# EasyEDA Pro project ProProject_音频功放设备耳放1_2025-05-13.epro

# Schematic Schematic1
Create Date: 2025-05-09; Page Name: P1; Project Name: 音频功放设备耳放1; Schematic Name: Schematic1; Update Date: 2025-05-13; Company: 嘉立创EDA; Page Size: A4; Version: V1.0
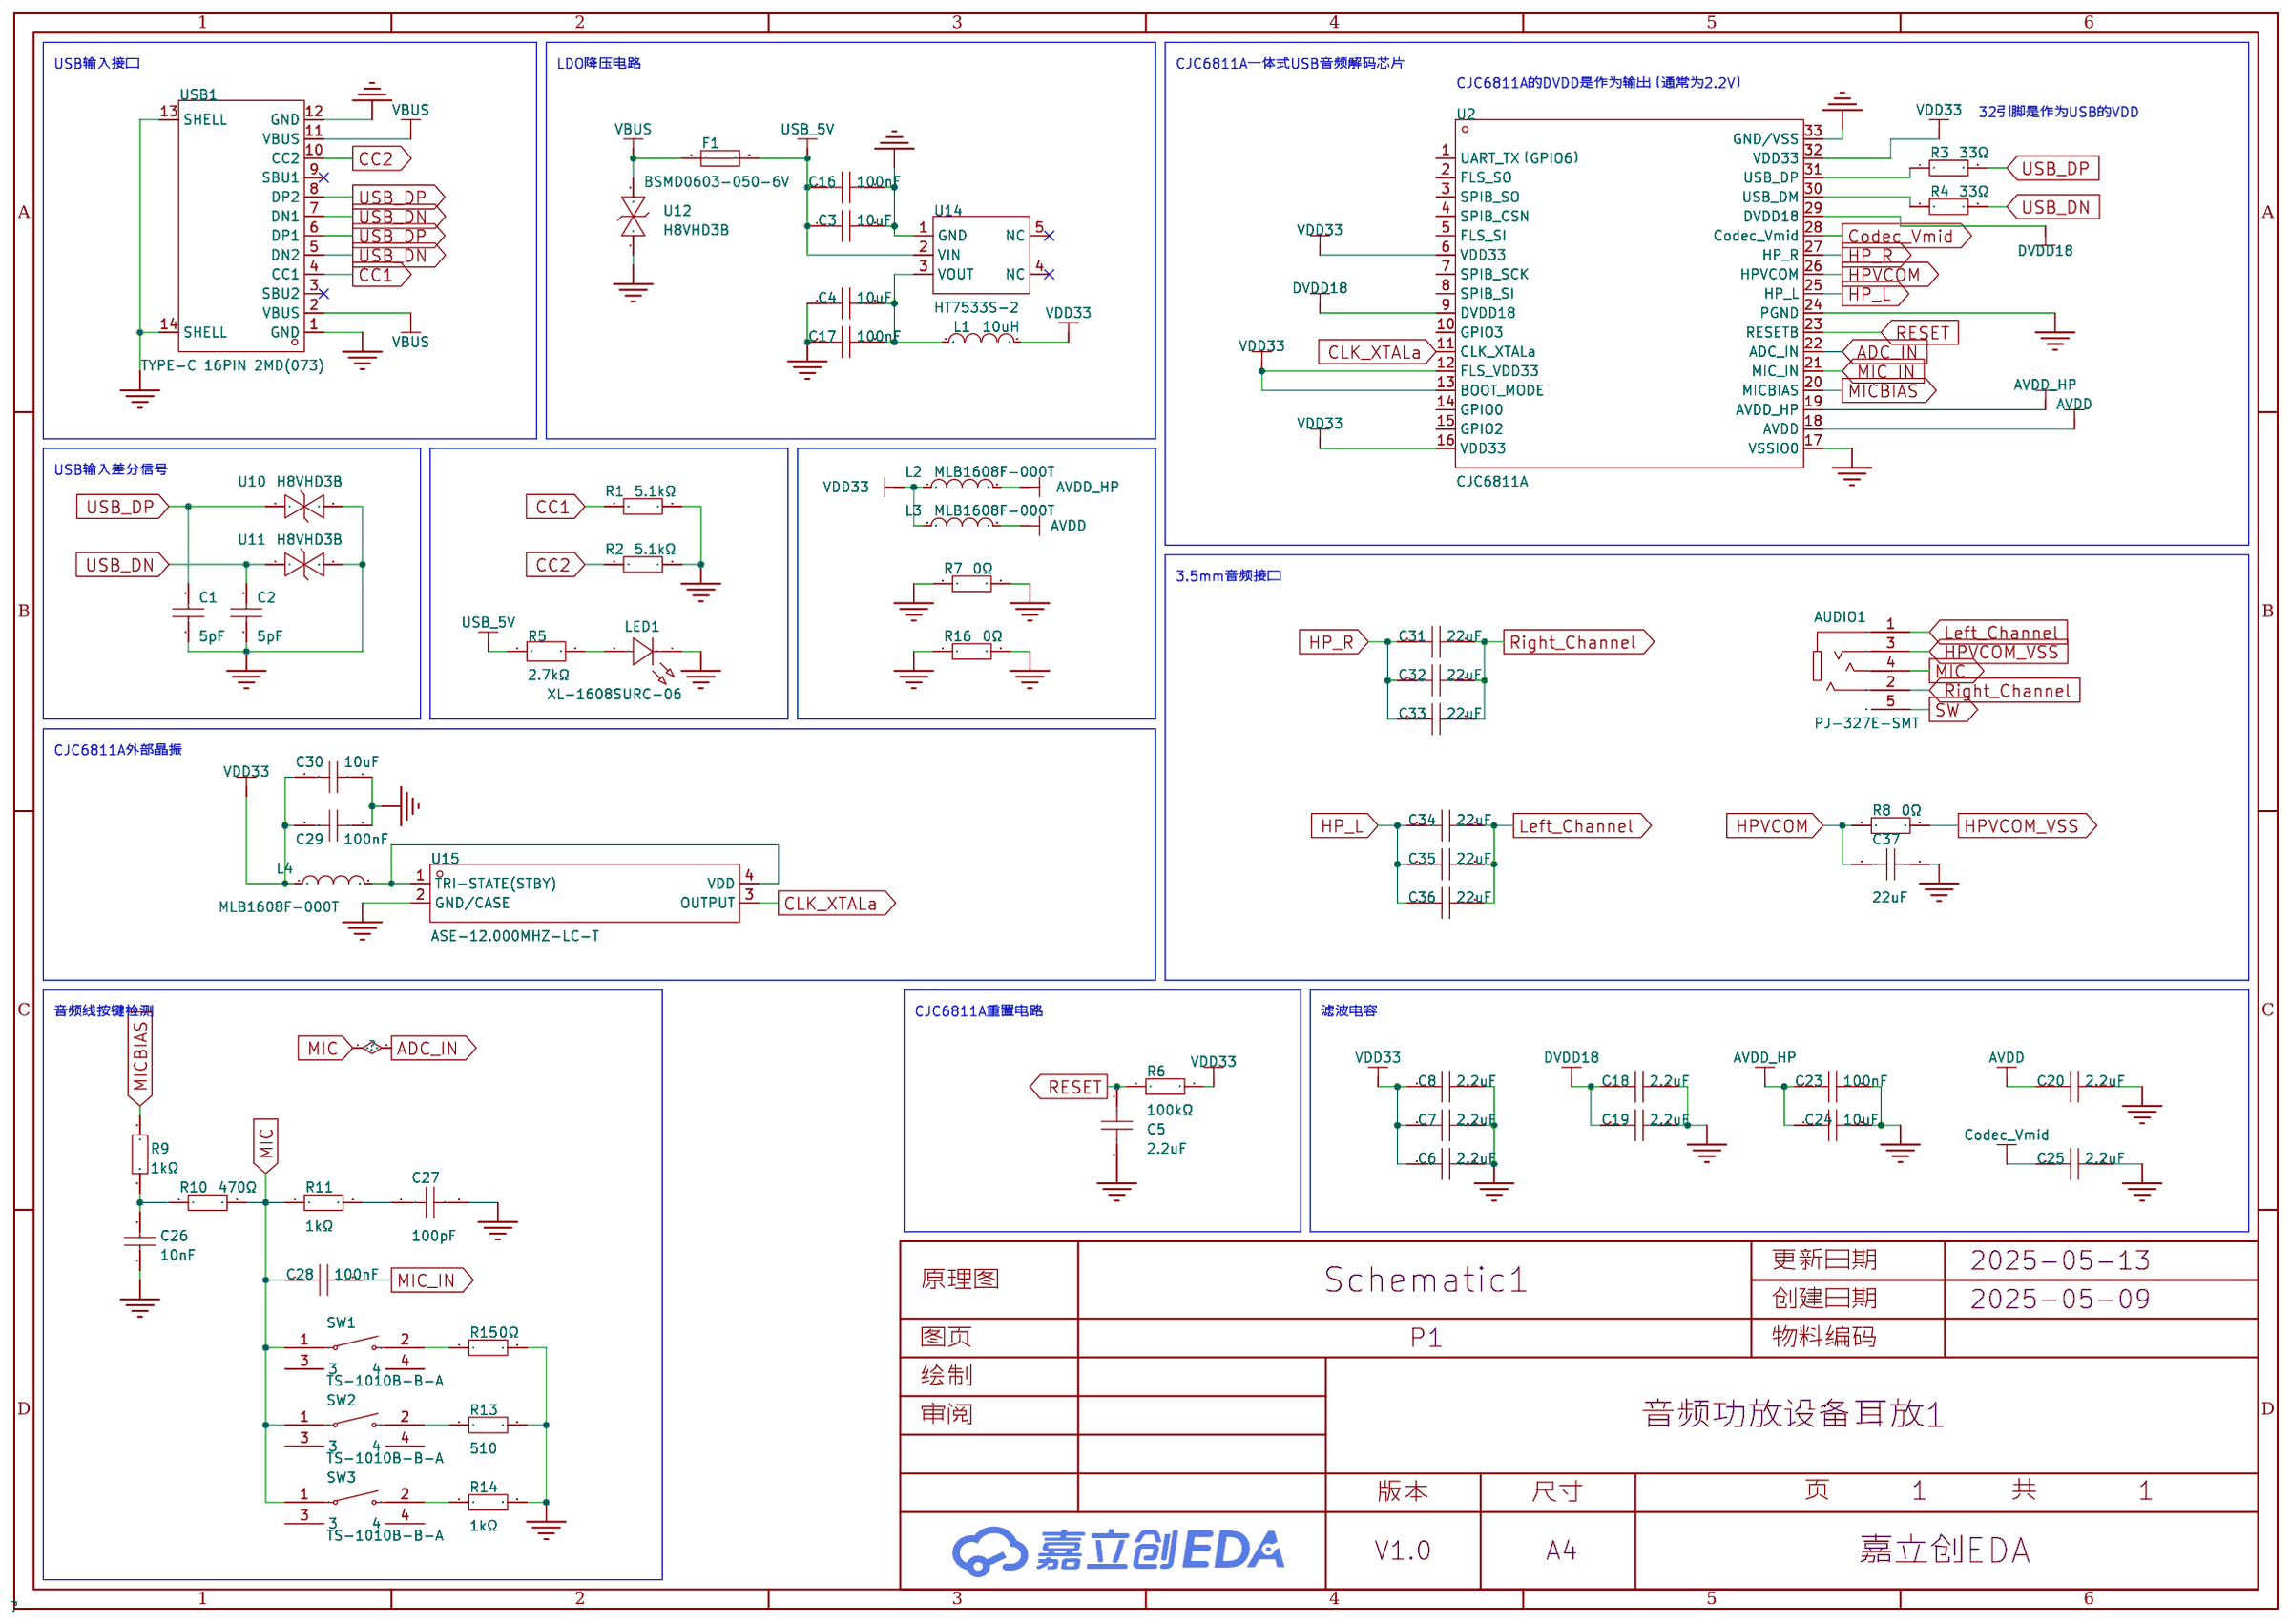
[diagram p0: schematic sheet]

## Parts
AUDIO1  PJ-327E-SMT  [AUDIO-SMD_PJ-327E-SMT]
C1  5pF  [C0603]
C2  5pF  [C0603]
C3  10uF  [C0603]
C4  10uF  [C0603]
C5  2.2uF  [C0603]
C6  2.2uF  [C0603]
C7  2.2uF  [C0603]
C8  2.2uF  [C0603]
C16  100nF  [C0603]
C17  100nF  [C0603]
C18  2.2uF  [C0603]
C19  2.2uF  [C0603]
C20  2.2uF  [C0603]
C23  100nF  [C0603]
C24  10uF  [C0603]
C25  2.2uF  [C0603]
C26  10nF  [C0603]
C27  100pF  [C0603]
C28  100nF  [C0603]
C29  100nF  [C0603]
C30  10uF  [C0603]
C31  22uF  [C0603]
C32  22uF  [C0603]
C33  22uF  [C0603]
C34  22uF  [C0603]
C35  22uF  [C0603]
C36  22uF  [C0603]
C37  22uF  [C0603]
F1  BSMD0603-050-6V  [F0603]
L1  10uH  [L0603]
L2  MLB1608F-000T  [L0603]
L3  MLB1608F-000T  [L0603]
L4  MLB1608F-000T  [L0603]
LED1  XL-1608SURC-06  [LED0603-RD_RED]
R1  5.1kΩ  [R0603]
R2  5.1kΩ  [R0603]
R3  33Ω  [R0603]
R4  33Ω  [R0603]
R5  2.7kΩ  [R0603]
R6  100kΩ  [R0603]
R7  0Ω  [R0603]
R8  0Ω  [R0603]
R9  1kΩ  [R0603]
R10  470Ω  [R0603]
R11  1kΩ  [R0603]
R13  510  [R0603]
R14  1kΩ  [R0603]
R15  0Ω  [R0603]
R16  0Ω  [R0603]
SW1  TS-1010B-B-A  [SW-SMD_TS-1010B-B-A]
SW2  TS-1010B-B-A  [SW-SMD_TS-1010B-B-A]
SW3  TS-1010B-B-A  [SW-SMD_TS-1010B-B-A]
U2  CJC6811A  [QFN-32_L5.0-W5.0-P0.50-BL-EP3.8]
U10  H8VHD3B  [SOD-323_L1.8-W1.3-LS2.7-BI]
U11  H8VHD3B  [SOD-323_L1.8-W1.3-LS2.7-BI]
U12  H8VHD3B  [SOD-323_L1.8-W1.3-LS2.7-BI]
U14  HT7533S-2  [SOT-23-5_L2.9-W1.6-P0.95-LS2.8-BR]
U15  ASE-12.000MHZ-LC-T  [OSC-SMD_4P-L3.2-W2.5-BL]
USB1  TYPE-C 16PIN 2MD(073)  [USB-C-SMD_TYPE-C-6PIN-2MD-073]

## Library data of the parts
AUDIO1 = PJ-327E-SMT: 连接器类型:3.5mm耳机座;额定电流:500mA;额定电压:30V;工作温度范围:-20℃~+70℃;焊接温度(最大值):235℃;; LCSC Part Name: 3.5mm耳机座; Supplier Part: C319105; Manufacturer: XKB Connectivity(中国星坤); Supplier Footprint: SMD; JLCPCB Part Class: 扩展库; Datasheet: https://atta.szlcsc.com/upload/public/pdf/source/20211015/5335F6344674457D7BC015F82D74A0C2.pdf; Supplier: LCSC; Connector Type: 3.5mm耳机座; Current Rating (Max): 500mA; Voltage Rating (Max): 30V; Operating Temperature Range: -20℃~+70℃; Soldering Temperature(Max): 235℃
C1 C2 = 0603CG5R0C500NT: 容值:5pF;额定电压:50V;温度系数:C0G;; LCSC Part Name: ±0.25pF 5pF 50V; Supplier Part: C1673; Manufacturer: FH(风华); Supplier Footprint: 0603; JLCPCB Part Class: 扩展库; Datasheet: https://atta.szlcsc.com/upload/public/pdf/source/20200305/C486355_26A10D38EF8C2A5C37091D0039909270.pdf; Supplier: LCSC; Voltage Rating: 50V; Temperature Coefficient: C0G
C3 C4 C24 C30 = CGA0603X5R106K100JT: 容值:10uF;精度:±10%;额定电压:10V;温度系数:X5R;; LCSC Part Name: 10uF ±10% 10V; Supplier Part: C6119842; Manufacturer: HRE(芯声); Supplier Footprint: 0603; JLCPCB Part Class: 扩展库; Supplier: LCSC; Tolerance: ±10%; Voltage Rating: 10V; Temperature Coefficient: X5R
C5-C8 C18-C20 C25 = CL10A225KB8NNNC: 容值:2.2uF;精度:±10%;额定电压:50V;材质(温度系数):X5R;; LCSC Part Name: 2.2uF ±10% 50V; Supplier Part: C913904; Manufacturer: SAMSUNG(三星); Supplier Footprint: 0603; JLCPCB Part Class: 扩展库; Datasheet: https://atta.szlcsc.com/upload/public/pdf/source/20160218/1457707763339.pdf; Supplier: LCSC; Tolerance: ±10%; Voltage Rated: 50V; Temperature Coefficient: X5R
C16 C17 C23 C28 C29 = CGA0603X7R104K500JT: 容值:100nF;精度:±10%;额定电压:50V;温度系数:X7R;; LCSC Part Name: 100nF ±10% 50V; Supplier Part: C6119867; Manufacturer: HRE(芯声); Supplier Footprint: 0603; JLCPCB Part Class: 扩展库; Datasheet: https://atta.szlcsc.com/upload/public/pdf/source/20250103/C44077DA9E7B3EFAE02F22B6D3D1CBC9.pdf; Supplier: LCSC; Tolerance: ±10%; Voltage Rating: 50V; Temperature Coefficient: X7R
C26 = CC0603KRX7R9BB103: 容值:10nF;精度:±10%;额定电压:50V;材质(温度系数):X7R;; LCSC Part Name: 10nF ±10% 50V; Supplier Part: C100042; Manufacturer: YAGEO(国巨); Supplier Footprint: 0603; JLCPCB Part Class: 扩展库; Datasheet: https://atta.szlcsc.com/upload/public/pdf/source/20181008/C309510_22F155564471FAF6A489F7D68F34234E.pdf; Supplier: LCSC; Tolerance: ±10%; Voltage Rated: 50V; Temperature Coefficient: X7R
C27 = CC0603JRNPO9BN101: 容值:100pF;精度:±5%;额定电压:50V;材质(温度系数):NP0;; LCSC Part Name: 100pF ±5% 50V; Supplier Part: C14665; Manufacturer: YAGEO(国巨); Supplier Footprint: 0603; JLCPCB Part Class: 扩展库; Datasheet: https://atta.szlcsc.com/upload/public/pdf/source/20181008/C309499_21CC21451B82C39E3D92150FD6B30293.pdf; Supplier: LCSC; Tolerance: ±5%; Voltage Rated: 50V; Temperature Coefficient: NP0
C31-C37 = CGA0603X5R226M160JT: 容值:22uF;精度:±20%;额定电压:16V;温度系数:X5R;; LCSC Part Name: 22uF ±20% 16V; Supplier Part: C6119868; Manufacturer: HRE(芯声); Supplier Footprint: 0603; JLCPCB Part Class: 扩展库; Datasheet: https://atta.szlcsc.com/upload/public/pdf/source/20250121/36E435B8815E1026A710792D223DB526.pdf; Supplier: LCSC; Tolerance: ±20%; Voltage Rating: 16V; Temperature Coefficient: X5R
F1 = BSMD0603-050-6V: 最大电压:6V;最大电流:40A;保持电流:500mA;跳闸电流:1A;; LCSC Part Name: 6V 500mA 0603自恢复; Supplier Part: C883095; Manufacturer: BHFUSE(佰宏); Supplier Footprint: 0603; JLCPCB Part Class: 扩展库; Datasheet: https://atta.szlcsc.com/upload/public/pdf/source/20230512/E478DE3555A0061DA0124A9F45802B86.pdf; Supplier: LCSC; Operating Voltage (Max): 6V; Current Rating (Max): 40A; Hold Current: 500mA; Trip Current: 1A; Power Dissipation: 500mW; Resistance - Initial (Ri) (Min): 100mΩ; Resistance - Post Trip (R1) (Max): 800mΩ; Maximum Time to Trip: 100ms; Operating Temperature: -40℃~+85℃
L1 = LQM18FN100M00D: 电感值:10uH;精度:±20%;额定电流:50mA;饱和电流(Isat):50mA;直流电阻(DCR):1.17Ω;; LCSC Part Name: 10uH ±20% 50mA 停产; Supplier Part: C86083; Manufacturer: muRata(村田); Supplier Footprint: 0603; JLCPCB Part Class: 扩展库; Datasheet: https://atta.szlcsc.com/upload/public/pdf/source/20181211/C324471_E5AB673E56FAD8B75EB4C57DC23E4148.pdf; Supplier: LCSC; Tolerance: ±20%; Current Rating: 50mA; Current - Saturation (Isat): 50mA; DC Resistance(DCR): 1.17Ω; Frequency - Self Resonant: 30MHz
L2-L4 = MLB1608F-000T: 阻抗@频率:0Ω@100MHz;误差:±25%;直流电阻(DCR):-;; LCSC Part Name: 单路 0603磁珠 阻抗0Ω@100MHz; Supplier Part: C2844549; Manufacturer: MetalLions(美铼); Supplier Footprint: 0603; JLCPCB Part Class: 扩展库; Datasheet: https://atta.szlcsc.com/upload/public/pdf/source/20230602/7F9B6FFD64AF4C161BE293D8440B9AF6.pdf; Supplier: LCSC; Impedance @ Frequency: 0Ω@100MHz; Tolerance: ±25%; Number of Circuits: 1
LED1 = XL-1608SURC-06: 灯头类型:-;发光颜色:红色;正向压降(Vf):2.3V;功率:50mW;正向电流:20mA;波长:620nm~630nm;二极管配置:-;透镜颜色:无色透明透镜;色温:-;发光强度:225mcd;发光角度:120°;载带方式:正贴;工作温度:-20℃~+85℃;; Supplier Part: C965799; Manufacturer: XINGLIGHT(成兴光); Supplier Footprint: 0603; JLCPCB Part Class: 扩展库; Datasheet: https://atta.szlcsc.com/upload/public/pdf/source/20250213/F9766CE804AF391355DCDD48DB3E0DAB.pdf; Supplier: LCSC; Illumination Color: 红色; Voltage - Forward(Vf): 2.3V; Power(Watts): 50mW; Forward Current: 20mA; Wavelength - Dominant: 620nm~630nm; Peak Wavelength: 625nm; Lens Color: 无色透明透镜; Luminous Intensity: 225mcd; Viewing Angle: 120°; Mounting Sytle: 正贴; Operating Temperature: -20℃~+85℃
R1 R2 = 0603WAF5101T5E: 电阻类型:厚膜电阻;阻值:5.1kΩ;精度:±1%;功率:100mW;最大工作电压:75V;温度系数:±100ppm/℃;; LCSC Part Name: 5.1kΩ ±1% 100mW 厚膜电阻; Supplier Part: C23186; Manufacturer: UNI-ROYAL(厚声); Supplier Footprint: 0603; JLCPCB Part Class: 基础库; Datasheet: https://atta.szlcsc.com/upload/public/pdf/source/20200306/C422600_1E6D84923E4A46A82E41ADD87F860B5C.pdf; Supplier: LCSC; Type: 厚膜电阻; Tolerance: ±1%; Power(Watts): 100mW; Overload Voltage (Max): 75V; Temperature Coefficient: ±100ppm/℃; Operating Temperature Range: -55℃~+155℃
R3 R4 = 0603WAF330JT5E: 电阻类型:厚膜电阻;阻值:33Ω;精度:±1%;功率:100mW;最大工作电压:75V;温度系数:±100ppm/℃;; LCSC Part Name: 33Ω ±1% 100mW 厚膜电阻; Supplier Part: C23140; Manufacturer: UNI-ROYAL(厚声); Supplier Footprint: 0603; JLCPCB Part Class: 基础库; Datasheet: https://atta.szlcsc.com/upload/public/pdf/source/20200306/C422600_1E6D84923E4A46A82E41ADD87F860B5C.pdf; Supplier: LCSC; Type: 厚膜电阻; Tolerance: ±1%; Power(Watts): 100mW; Overload Voltage (Max): 75V; Temperature Coefficient: ±100ppm/℃; Operating Temperature Range: -55℃~+155℃
R5 = FRC0603F2701TS: 电阻类型:厚膜电阻;阻值:2.7kΩ;精度:±1%;功率:100mW;工作电压:75V;温度系数:±100ppm/℃;; LCSC Part Name: 2.7kΩ ±1% 100mW 厚膜电阻; Supplier Part: C2907008; Manufacturer: FOJAN(富捷); Supplier Footprint: 0603; JLCPCB Part Class: 扩展库; Datasheet: https://atta.szlcsc.com/upload/public/pdf/source/20211221/925EC7D7225764EE0046F22065062C87.pdf; Supplier: LCSC; Type: 厚膜电阻; Tolerance: ±1%; Power(Watts): 100mW; Voltage-Supply(Max): 75V; Temperature Coefficient: ±100ppm/℃; Operating Temperature: -55℃~+155℃
R6 = 0603WAF1003T5E: 电阻类型:厚膜电阻;阻值:100kΩ;精度:±1%;功率:100mW;最大工作电压:75V;温度系数:±100ppm/℃;; LCSC Part Name: 100kΩ ±1% 100mW 厚膜电阻; Supplier Part: C25803; Manufacturer: UNI-ROYAL(厚声); Supplier Footprint: 0603; JLCPCB Part Class: 基础库; Datasheet: https://atta.szlcsc.com/upload/public/pdf/source/20200306/C422600_1E6D84923E4A46A82E41ADD87F860B5C.pdf; Supplier: LCSC; Type: 厚膜电阻; Tolerance: ±1%; Power(Watts): 100mW; Overload Voltage (Max): 75V; Temperature Coefficient: ±100ppm/℃; Operating Temperature Range: -55℃~+155℃
R7 R8 R15 R16 = 0603WAF0000T5E: 电阻类型:厚膜电阻;阻值:0Ω;精度:±1%;功率:100mW;最大工作电压:75V;; LCSC Part Name: 0Ω ±1% 100mW 厚膜电阻; Supplier Part: C21189; Manufacturer: UNI-ROYAL(厚声); Supplier Footprint: 0603; JLCPCB Part Class: 基础库; Datasheet: https://atta.szlcsc.com/upload/public/pdf/source/20200306/C422600_1E6D84923E4A46A82E41ADD87F860B5C.pdf; Supplier: LCSC; Type: 厚膜电阻; Tolerance: ±1%; Power(Watts): 100mW; Overload Voltage (Max): 75V; Operating Temperature Range: -55℃~+155℃
R9-R11 R13 R14 = 0603WAF1001T5E: 电阻类型:厚膜电阻;阻值:1kΩ;精度:±1%;功率:100mW;最大工作电压:75V;温度系数:±100ppm/℃;; LCSC Part Name: 1kΩ ±1% 100mW 厚膜电阻; Supplier Part: C21190; Manufacturer: UNI-ROYAL(厚声); Supplier Footprint: 0603; JLCPCB Part Class: 基础库; Datasheet: https://atta.szlcsc.com/upload/public/pdf/source/20200306/C422600_1E6D84923E4A46A82E41ADD87F860B5C.pdf; Supplier: LCSC; Type: 厚膜电阻; Tolerance: ±1%; Power(Watts): 100mW; Overload Voltage (Max): 75V; Temperature Coefficient: ±100ppm/℃; Operating Temperature Range: -55℃~+155℃
SW1-SW3 = TS-1010B-B-A: 电路结构:单刀单掷;按钮形状:矩形按钮;作用力:160gf;安装方式:卧贴;开关长度:4.5mm;开关宽度:2.65mm;开关高度:3.5mm;带支架:不带;触点电流:50mA;额定电压(DC):12V;绝缘电阻:-;带灯:无;机械寿命:10万次;; LCSC Part Name: 4.5*2.65*3.5mm 卧贴 轻触开关; Supplier Part: C381061; Manufacturer: XKB Connectivity(中国星坤); Supplier Footprint: SMD; JLCPCB Part Class: 扩展库; Datasheet: https://atta.szlcsc.com/upload/public/pdf/source/20211011/F72F5FEE4FD72D7D4E4CB639ADBA973D.pdf; Supplier: LCSC; Circuit: 单刀单掷; Actuator Style: 矩形按钮; Operating Force: 160gf; Mounting Style: 卧贴; Switch Length: 4.5mm; Switch Width: 2.65mm; Switch Height: 3.5mm; Strike Gundam: 不带; Contact Current: 50mA; Voltage Rating (DC): 12V; Actuator/Cap Color: 黑色; With Lamp: 无; Mechanical Life: 10万次; Operating Temperature: -30℃~+85℃
U2 = CJC6811A: CPU内核:ARM-M0;程序存储容量:16KB;RAM总容量:16KB;GPIO端口数量:8;工作电压范围:3.3V；1.8V;CPU最大主频:48MHz;程序存储器类型:FLASH;应用领域:-;; Supplier Part: C7431488; Manufacturer: ESHINE(光华芯); Supplier Footprint: QFN5x5-32; JLCPCB Part Class: 扩展库; Datasheet: https://atta.szlcsc.com/upload/public/pdf/source/20241022/C58A102F2C32FEE211FA9C4A97D650DF.pdf; Supplier: LCSC; CPU Core: ARM-M0; Program Storage Size: 16KB; RAM Size: 16KB; GPIO Ports Number: 8; Operating Voltage Range: 3.3V；1.8V; CPU Maximum Speed: 48MHz; Program Memory Type: FLASH; Operating Temperature Range: -20℃~+85℃; 8Bit Timer: 8; 32Bit Timer: 1; UART/USART: 1; I2C: 1; I2S: 1; SPI: 1; Universal Serial Bus: 有; Internal Comparator: 有; Watchdog: 有; Real-Time Clock: 有
U10-U12 = H8VHD3B: 极性:双向;反向截止电压(Vrwm):8V;最大钳位电压:25V;峰值脉冲电流(Ipp):20A;峰值脉冲功率(Ppp):500W;击穿电压:11.5V;; LCSC Part Name: 丝印:AK; Supplier Part: C20615808; Manufacturer: 宏迦橙; Supplier Footprint: SOD-323; JLCPCB Part Class: 扩展库; Datasheet: https://atta.szlcsc.com/upload/public/pdf/source/20240126/4F161BEC9E1B7DCE7F484736647B69CA.pdf; Supplier: LCSC; polarity: 双向; Reverse Stand-Off Voltage (Vrwm): 8V; Maximum Clamping Voltage: 25V; Peak Pulse Current (Ipp): 20A; Peak Pulse Power Dissipation (Ppp): 500W; Breakdown Voltage: 11.5V; Reverse Leakage Current (Ir): 100nA; Operating Temperature: -55℃~+155℃; Type: ESD
U14 = HT7533S-2: 输出类型:固定;工作电压:30V;输出电压:3.3V;输出电流:100mA;电源纹波抑制比(PSRR):-;输出极性:正极;; LCSC Part Name: 线性稳压(LDO); Supplier Part: C3025150; Manufacturer: UMW(友台半导体); Supplier Footprint: SOT-23-5; JLCPCB Part Class: 扩展库; Datasheet: https://atta.szlcsc.com/upload/public/pdf/source/20241210/442D8F583BE08BBCCA568BF38D964031.pdf; Supplier: LCSC; Output Type: 固定; Voltage - Supply: 30V; Output Voltage: 3.3V; Output Current: 100mA; standby current: 2uA; Operating Temperature: -40℃~+85℃; Output Configuration: 正极; Number of Outputs: 1
U15 = ASE-12.000MHZ-LC-T: Supplier Part: C596950; Manufacturer: ABRACON; Supplier Footprint: SMD3225-4P; JLCPCB Part Class: 扩展库; Datasheet: https://atta.szlcsc.com/upload/public/pdf/source/231023/C17182292-f03cdafcace4e2e49e91c2fa8e41e967.pdf; Supplier: LCSC
USB1 = TYPE-C 16PIN 2MD(073): 连接器类型:Type-C;标准:USB 3.1;公母:母;安装方式:卧贴;触点数量:16P;端口数量:1;额定电流 - 电源:5A;工作温度范围:-25℃~+85℃;; LCSC Part Name: Type-C 母 卧贴; Supplier Part: C2765186; Manufacturer: SHOU HAN(首韩); Supplier Footprint: SMD; JLCPCB Part Class: 扩展库; Datasheet: https://atta.szlcsc.com/upload/public/pdf/source/20211123/39B17C16241EAC15C5E277BDA434118E.pdf; Supplier: LCSC; Connector Type: Type-C; Standard: USB 3.1; Gender: 母; Mounting Style: 卧贴; Number of Contacts: 16P; Number of Ports: 1; Current Rating - Power (Max): 5A; Operating Temperature Range: -25℃~+85℃; Rated Voltage (Max): 5V; Connect-Disconnect Life: 5千次; Core Colour: 黑色

## Nets
AGND: C37.2 R13.2 R14.2 R15.2 R16.1 U2.24(PGND)
AVDD: C20.2 L3.2 U2.18(AVDD)
AVDD_HP: C23.1 C24.1 L2.2 U2.19(AVDD_HP)
DGND: U2.33(GND/VSS)
DVDD18: C18.2 C19.2 U2.9(DVDD18) U2.29(DVDD18)
GND: C1.1 C2.1 C5.1 C6.1 C7.1 C8.1 C18.1 C19.1 C20.1 C23.2 C24.2 C25.1 C26.2 C27.2 C29.1 C30.1 R1.2 R2.2 R7.2 R16.2 U2.17(VSSIO0) U10.2 U11.2 U15.2(GND/CASE) USB1.1(GND) USB1.12(GND) USB1.13(SHELL) USB1.14(SHELL)
PGND: C3.2 C4.1 C16.2 C17.1 LED1.1(K) R7.1 U12.1 U14.1(GND)
VBUS: F1.1 U12.2 USB1.2(VBUS) USB1.11(VBUS)
VDD33: C6.2 C7.2 C8.2 C29.2 C30.2 L1.2 L2.1 L3.1 L4.1 R6.2 U2.6(VDD33) U2.12(FLS_VDD33) U2.13(BOOT_MODE) U2.16(VDD33) U2.32(VDD33)
ADC_IN: AUDIO1.4 C28.1 R10.2 R11.1 SW1.1 SW2.1 SW3.1 U2.22(ADC_IN)
CC1: R1.1 USB1.4(CC1)
CC2: R2.1 USB1.10(CC2)
CLK_XTALa: U2.11(CLK_XTALa) U15.3(OUTPUT)
Codec_Vmid: C25.2 U2.28(Codec_Vmid)
HP_L: C34.1 C35.1 C36.1 U2.25(HP_L)
HP_R: C31.1 C32.1 C33.1 U2.27(HP_R)
HPVCOM: C37.1 R8.1 U2.26(HPVCOM)
HPVCOM_VSS: AUDIO1.3 R8.2
Left_Channel: AUDIO1.1 C34.2 C35.2 C36.2
MIC_IN: C28.2 U2.21(MIC_IN)
MICBIAS: R9.1 U2.20(MICBIAS)
RESET: C5.2 R6.1 U2.23(RESETB)
Right_Channel: AUDIO1.2 C31.2 C32.2 C33.2
SW: AUDIO1.5
USB_5V: C3.1 C16.1 F1.2 R5.1 U14.2(VIN)
USB_DN: C2.2 R4.2 U11.1 USB1.5(DN2) USB1.7(DN1)
USB_DP: C1.2 R3.2 U10.1 USB1.6(DP1) USB1.8(DP2)
$1N3255: R3.1 U2.31(USB_DP)
$1N3294: R4.1 U2.30(USB_DM)
$1N3811: LED1.2(A) R5.2
$1N6901: C4.2 C17.2 L1.1 U14.3(VOUT)
$1N9188: C26.1 R9.2 R10.1
$1N9400: C27.1 R11.2
$1N10061: R15.1 SW1.2
$1N10064: R13.1 SW2.2
$1N10067: R14.1 SW3.2
$1N10464: L4.2 U15.1(TRI-STATE(STBY)) U15.4(VDD)

Not connected (* = marked no-connect by the designer): SW1 3 4; SW2 3 4; SW3 3 4; U2 1(UART_TX（GPIO6）) 2(FLS_SO) 3(SPIB_SO) 4(SPIB_CSN) 5(FLS_SI) 7(SPIB_SCK) 8(SPIB_SI) 10(GPIO3) 14(GPIO0) 15(GPIO2); U14 4(NC)* 5(NC)*; USB1 3(SBU2)* 9(SBU1)*

## Notes on the sheet
- USB输入接口
- LDO降压电路
- CJC6811A一体式USB音频解码芯片
- CJC6811A的DVDD是作为输出（通常为2.2V）
- 32引脚是作为USB的VDD
- USB输入差分信号
- 3.5mm音频接口
- CJC6811A外部晶振
- 音频线按键检测
- CJC6811A重置电路
- 滤波电容

# Board PCB1
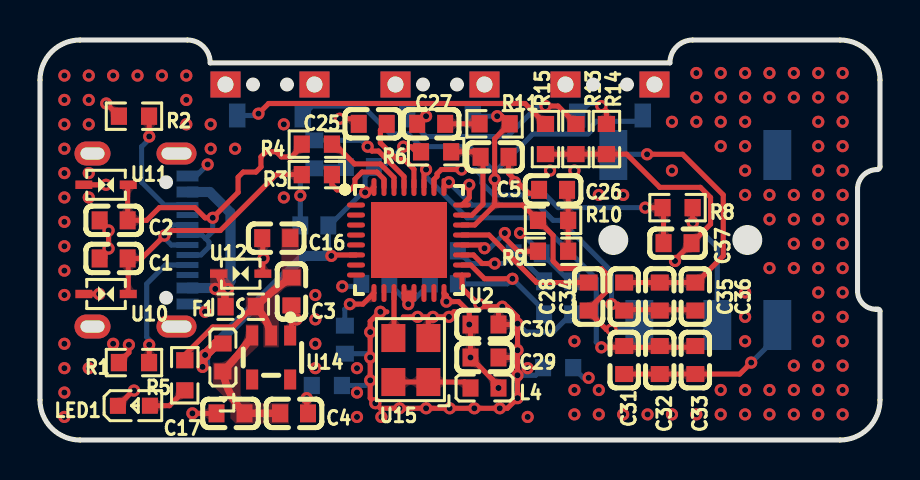
[diagram p1: board, top side]
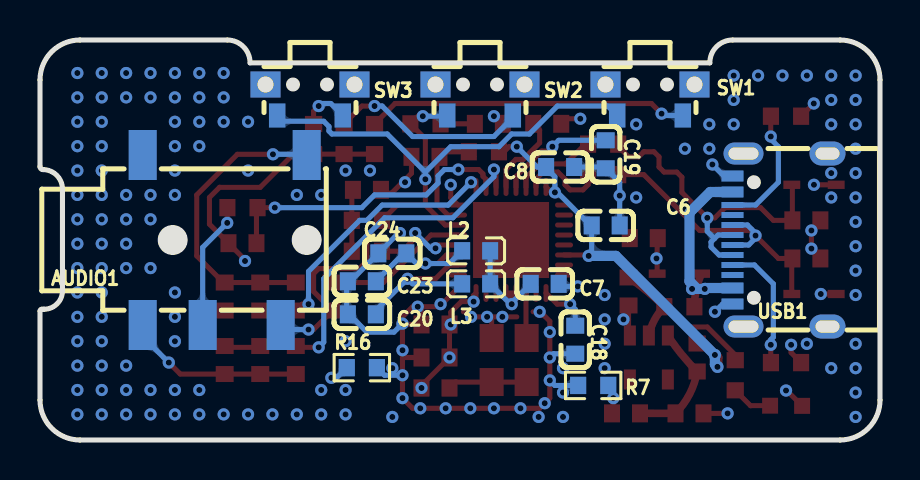
[diagram p2: board, bottom side, seen from below]

Outline 42 x 20 mm; copper layers: Top Layer, Inner1, Inner2, Bottom Layer. Coordinates in mm from the lower left corner of the outline.
Outline path: 0,18 arc(0.59,19.41) 2,20 7.37,20 arc(8.17,19.67) 8.51,18.86 31.5,18.86 arc(31.83,19.67) 32.64,20 40,20 arc(41.41,19.41) 42,18 42,13.66 arc(41.96,13.56) 41.86,13.52 arc(41.16,13.23) 40.88,12.54 40.88,7.46 arc(41.15,6.81) 41.8,6.54 41.91,6.54 arc(41.97,6.51) 42,6.45 42,2 arc(41.41,0.59) 40,0 2,0 arc(0.59,0.59) 0,2 0,18
Stack: Top Layer 0.035mm 外层铜厚1oz / Dielectric1 0.2104mm 7628 RC49% 8.6mil / Inner1 0.0152mm 内层铜厚 / Dielectric2 1.065mm 1.1mm H/HOZ 含铜 / Inner2 0.0152mm 内层铜厚 / Dielectric3 0.2104mm 7628 RC49% 8.6mil / Bottom Layer 0.035mm 外层铜厚1oz

## Design rules (mm)
net $1N3294: DP1
net $1N3255: DP1
template: JLCPCB Capability(Two Layers Board)
spacing copperThickness1oz (default): track to track 0.102, other pairs 0.152 to 0.3
spacing copperThickness2oz: track to track 0.203, other pairs 0.152 to 0.3
track width copperThickness1oz (default): min 0.127, default 0.254, max 2.54
track width copperThickness2oz: min 0.203, default 0.254, max 2.54
differential pair differentialPair (default): width min 0.127, default 0.254, max 2.54; gap min 0.152, default 0.152
via viaSize (default): diameter min 0.5, default 0.61, max 10; hole min 0.3, default 0.305, max 6.3

## Placement (name value [footprint] x y rotation side)
AUDIO1  PJ-327E-SMT  [AUDIO-SMD_PJ-327E-SMT]  32.77 10 270 bottom
C1  5pF  [C0603]  3.68 9.08 0 top
C2  5pF  [C0603]  3.68 10.98 0 top
C3  10uF  [C0603]  12.57 7.43 270 top
C4  10uF  [C0603]  12.7 1.33 180 top
C5  2.2uF  [C0603]  22.73 14.16 180 top
C6  2.2uF  [C0603]  13.72 10.73 0 bottom
C7  2.2uF  [C0603]  16.76 7.81 0 bottom
C8  2.2uF  [C0603]  15.99 13.65 0 bottom
C16  100nF  [C0603]  11.81 10.09 180 top
C17  100nF  [C0603]  9.53 1.33 0 top
C18  2.2uF  [C0603]  15.24 5.01 90 bottom
C19  2.2uF  [C0603]  13.72 14.28 90 bottom
C20  2.2uF  [C0603]  25.91 6.28 180 bottom
C23  100nF  [C0603]  25.91 7.94 0 bottom
C24  10uF  [C0603]  24.38 9.33 0 bottom
C25  2.2uF  [C0603]  16.64 15.81 0 top
C26  10nF  [C0603]  25.65 12.51 180 top
C27  100pF  [C0603]  19.56 15.81 180 top
C28  100nF  [C0603]  27.43 7.17 90 top
C29  100nF  [C0603]  22.22 4.12 180 top
C30  10uF  [C0603]  22.22 5.78 180 top
C31  22uF  [C0603]  29.21 4 270 top
C32  22uF  [C0603]  30.99 4 270 top
C33  22uF  [C0603]  32.77 4 270 top
C34  22uF  [C0603]  29.21 7.17 90 top
C35  22uF  [C0603]  30.99 7.17 90 top
C36  22uF  [C0603]  32.77 7.17 90 top
C37  22uF  [C0603]  31.88 9.84 0 top
F1  BSMD0603-050-6V  [F0603]  10.03 6.67 0 top
L1  10uH  [L0603]  9.14 4.12 90 top
L2  MLB1608F-000T  [L0603]  20.19 9.46 0 bottom
L3  MLB1608F-000T  [L0603]  20.19 7.81 0 bottom
L4  MLB1608F-000T  [L0603]  22.22 2.6 180 top
LED1  XL-1608SURC-06  [LED0603-RD_RED]  4.69 1.71 0 top
R1  5.1kΩ  [R0603]  4.7 3.87 180 top
R2  5.1kΩ  [R0603]  4.7 16.19 180 top
R3  33Ω  [R0603]  13.84 13.27 180 top
R4  33Ω  [R0603]  13.84 14.79 180 top
R5  2.7kΩ  [R0603]  7.24 3.24 270 top
R6  100kΩ  [R0603]  19.81 14.41 180 top
R7  0Ω  [R0603]  14.34 2.73 0 bottom
R8  0Ω  [R0603]  31.88 11.62 0 top
R9  1kΩ  [R0603]  25.65 9.44 0 top
R10  470Ω  [R0603]  25.65 10.98 180 top
R11  1kΩ  [R0603]  22.73 15.81 180 top
R13  510  [R0603]  26.8 15.05 270 top
R14  1kΩ  [R0603]  28.32 15.05 270 top
R15  0Ω  [R0603]  25.27 15.05 270 top
R16  0Ω  [R0603]  25.91 3.62 180 bottom
SW1  TS-1010B-B-A  [SW-SMD_TS-1010B-B-A]  11.5 17 180 bottom
SW2  TS-1010B-B-A  [SW-SMD_TS-1010B-B-A]  20 17 180 bottom
SW3  TS-1010B-B-A  [SW-SMD_TS-1010B-B-A]  28.5 17 180 bottom
U2  CJC6811A  [QFN-32_L5.0-W5.0-P0.50-BL-EP3.8]  18.45 10 270 top
U10  H8VHD3B  [SOD-323_L1.8-W1.3-LS2.7-BI]  3.3 7.3 180 top
U11  H8VHD3B  [SOD-323_L1.8-W1.3-LS2.7-BI]  3.3 12.76 180 top
U12  H8VHD3B  [SOD-323_L1.8-W1.3-LS2.7-BI]  10.03 8.32 180 top
U14  HT7533S-2  [SOT-23-5_L2.9-W1.6-P0.95-LS2.8-BR]  11.56 4.12 90 top
U15  ASE-12.000MHZ-LC-T  [OSC-SMD_4P-L3.2-W2.5-BL]  18.54 4 90 top
USB1  TYPE-C 16PIN 2MD(073)  [USB-C-SMD_TYPE-C-6PIN-2MD-073]  5 10 90 bottom

## Footprints (pads in the part's own frame, mm; a bottom-side part is the same pattern mirrored in y, then rotated)
AUDIO-SMD_PJ-327E-SMT
  rect 2.5x1.4 smd: 1(-4.25,4.1) 2(4.25,-4.1) 3(4.25,-1.1) 4(4.25,2.8) 5(-4.25,-4.1)
C0603
  rect 0.8x0.9 smd: 1(-0.7,0) 2(0.7,0)
F0603
  rect 0.806x0.864 smd: 1(-0.753,0) 2(0.753,0)
L0603
  rect 0.8x0.864 smd: 1(-0.7,0) 2(0.7,0)
LED0603-RD_RED
  rect 0.8x0.8 smd: 1(-0.799,-0.004) 2(0.799,0.004)
OSC-SMD_4P-L3.2-W2.5-BL
  rect 1.4x1.2 smd: 1(-1.1,-0.875) 2(1.1,-0.875) 3(1.1,0.875) 4(-1.1,0.875)
QFN-32_L5.0-W5.0-P0.50-BL-EP3.8
  oval 0.25x0.9 smd: 1(-1.75,-2.65) 2(-1.25,-2.65) 3(-0.749,-2.65) 4(-0.249,-2.65) 5(0.249,-2.65) 6(0.75,-2.65) 7(1.25,-2.65) 8(1.75,-2.65) 17(1.75,2.65) 18(1.25,2.65) 19(0.75,2.65) 20(0.249,2.65) 21(-0.249,2.65) 22(-0.749,2.65) 23(-1.25,2.65) 24(-1.75,2.65)
  oval 0.9x0.25 smd: 9(2.65,-1.75) 10(2.65,-1.25) 11(2.65,-0.75) 12(2.65,-0.249) 13(2.65,0.249) 14(2.65,0.749) 15(2.65,1.25) 16(2.65,1.75) 25(-2.65,1.75) 26(-2.65,1.25) 27(-2.65,0.749) 28(-2.65,0.249) 29(-2.65,-0.249) 30(-2.65,-0.75) 31(-2.65,-1.25) 32(-2.65,-1.75)
  rect 3.8x3.8 smd: 33(0,0)
R0603
  rect 0.806x0.864 smd: 1(-0.753,0) 2(0.753,0)
SOD-323_L1.8-W1.3-LS2.7-BI
  rect 0.845x0.42 smd: 1(-1.11,0) 2(1.11,0)
SOT-23-5_L2.9-W1.6-P0.95-LS2.8-BR
  rect 1x0.6 smd: 1(1.1,-0.95) 2(1.1,0) 3(1.1,0.95) 4(-1.1,0.95) 5(-1.1,-0.95)
SW-SMD_TS-1010B-B-A
  rect 0.825x1.2 smd: 1(-1.64,-0.775) 2(1.64,-0.775)
  rect 1.5x1.3 hole 0.8: 3(-2.225,0.775) 4(2.225,0.775)
USB-C-SMD_TYPE-C-6PIN-2MD-073
  rect 0.55x1.1 smd: 1(-3.2,2.375) 2(-2.4,2.375) 11(2.4,2.375) 12(3.2,2.375)
  rect 0.3x1.1 smd: 3(-1.75,2.375) 4(-1.25,2.375) 5(-0.75,2.375) 6(-0.25,2.375) 7(0.25,2.375) 8(0.75,2.375) 9(1.25,2.375) 10(1.75,2.375)
  oval 1.2x1.8 hole 0.6x1.2: 13(-4.325,-2.375) 14(4.325,-2.375)
  oval 1.1x2 hole 0.6x1.5: 13(-4.325,1.825) 14(4.325,1.825)

## Nets
As in the schematic, except:
CLK_XTALA: U2.11 U15.3
CODEC_VMID: C25.2 U2.28
LEFT_CHANNEL: AUDIO1.1 C34.2 C35.2 C36.2
RIGHT_CHANNEL: AUDIO1.2 C31.2 C32.2 C33.2

Pads without a net: SW1 3 4; SW2 3 4; SW3 3 4; U2 1 2 3 4 5 7 8 10 14 15; U14 4 5; USB1 3 9

## Via types
v1: diameter 0.61, hole 0.305, Top Layer to Bottom Layer, 201 vias

## Routing (per net, layer and track width the routed paths; a pad name or vN(x,y) marks a point on that pad's centre or on a via; arc(x,y) is an arc through that point)
AGND: length 121.2
  Top Layer w0.254: v1(31.75,8.95) 31.75,9.01 C37.2 33.53,10.79 33.53,12.13 33.02,12.63 30.99,12.63 29.33,14.29 R14.2 R13.2 R15.2 ; U2.24 21.46,12.11 v1(21.46,12.76)
  Inner1 w0.254: 22.5,13.8 23.85,13.8 24.76,12.89 24.76,10.09 24.26,9.59 23.11,9.59 21.84,10.86 19.81,10.86 19.81,8.06 20.32,7.55 23.05,7.55 25.74,4.87 25.74,1.37 26.69,0.43 30.18,0.43 ; 22.5,13.8 v1(21.46,12.76) 20.96,12.25 19.69,12.25 16.69,15.25 15.75,15.25 15.75,15.68 18.67,15.68 18.8,15.56 19.69,15.56 19.94,15.81 19.94,16.57 20.19,16.83 23.11,16.83 23.5,17.21 23.5,18.09 23.75,18.35 25.02,18.35 25.15,18.22 25.15,17.33 25.02,17.33 24.64,16.95 24.64,16.19 24.76,16.06 ; 22.5,13.8 24.76,16.06 ; 24.76,16.06 28.83,16.06 29.34,16.57 31.62,16.57 32.13,17.08 32.13,18.73 32.97,19.57 40,19.57 arc(41.11,19.11) 41.57,18 41.57,13.98 41.49,13.9 arc(40.74,13.4) 40.45,12.54 40.45,7.46 arc(40.75,6.61) 41.53,6.14 ; 30.18,0.43 40,0.43 arc(40.97,0.76) 41.53,1.62 ; 30.18,0.43 30.35,0.43 ; 41.53,6.14 41.53,3.45 41.54,3.43 41.54,1.7 ; 41.53,6.14 arc(41.55,6.13) 41.57,6.13 ; 41.54,1.7 arc(41.54,1.66) 41.53,1.62 ; 41.54,1.7 arc(41.57,1.85) 41.57,2 ; 41.54,1.7 arc(41.54,1.66) 41.53,1.62
  Bottom Layer w0.254: v1(27.43,3.11) 27.17,3.11 R16.1
  vias: v1(25.5,13.47) v1(26.72,13.47) v1(26.72,4.94) v1(26.72,2.5) v1(26.72,1.28) v1(27.94,12.25) v1(27.94,2.5) v1(27.94,1.28) v1(29.16,12.25) v1(29.16,1.28) v1(30.38,1.28) v1(31.6,15.91) v1(31.6,13.47) v1(31.6,1.28) v1(32.82,18.35) v1(32.82,17.13) v1(32.82,15.91) v1(32.82,1.28) v1(34.04,18.35) v1(34.04,17.13) v1(34.04,15.91) v1(34.04,14.69) v1(34.04,2.5) v1(34.04,1.28) v1(35.25,18.35) v1(35.25,17.13) v1(35.25,15.91) v1(35.25,14.69) v1(35.25,13.47) v1(35.25,12.25) v1(35.25,7.38) v1(35.25,6.16) v1(35.25,4.94) v1(35.25,2.5) v1(35.25,1.28) v1(36.47,18.35) v1(36.47,17.13) v1(36.47,12.25) v1(36.47,11.03) v1(36.47,8.6) v1(36.47,2.5) v1(36.47,1.28) v1(37.69,18.35) v1(37.69,17.13) v1(37.69,12.25) v1(37.69,11.03) v1(37.69,9.81) v1(37.69,8.6) v1(37.69,3.72) v1(37.69,2.5) v1(37.69,1.28) v1(38.91,18.35) v1(38.91,17.13) v1(38.91,15.91) v1(38.91,14.69) v1(38.91,13.47) v1(38.91,12.25) v1(38.91,11.03) v1(38.91,9.81) v1(38.91,8.6) v1(38.91,7.38) v1(38.91,6.16) v1(38.91,4.94) v1(38.91,3.72) v1(38.91,2.5) v1(38.91,1.28) v1(40.13,18.35) v1(40.13,17.13) v1(40.13,15.91) v1(40.13,14.69) v1(40.13,13.47) v1(40.13,12.25) v1(40.13,11.03) v1(40.13,9.81) v1(40.13,8.6) v1(40.13,7.38) v1(40.13,6.16) v1(40.13,4.94) v1(40.13,3.72) v1(40.13,2.5) v1(40.13,1.28)
AVDD: length 8.1
  Top Layer w0.254: U2.18 21.54,8.75 22.22,8.06 v1(23.62,8.06)
  Bottom Layer w0.254: C20.2 25.21,6.48 v1(23.62,8.06) 23.37,7.81 L3.2
AVDD_HP: length 7.2
  Top Layer w0.254: U2.19 21.68,9.25 22.1,8.82 v1(22.73,8.82)
  Bottom Layer w0.254: C23.1 23.84,9.3 23.65,9.3 ; 23.65,9.3 23.18,8.82 v1(22.73,8.82) 21.53,8.82 L2.2 ; 23.65,9.3 C24.1
DVDD18: length 17.4
  Top Layer w0.254: v1(15.49,6.79) 16.14,6.79 U2.9 ; U2.29 18.2,13.17 16.93,14.45 16.6,14.45 v1(16.38,14.67)
  Inner2 w0.254: v1(15.49,6.79) 17.27,8.57 17.27,13.78 v1(16.38,14.67)
  Bottom Layer w0.254: C18.2 15.24,6.54 v1(15.49,6.79) ; C19.2 16.06,14.98 v1(16.38,14.67)
GND: length 118.5
  Top Layer w0.254: C29.1 23.75,4.12 ; v1(14.99,16.06) 15.68,16.06 C25.1 ; 22.99,5.78 23.83,5.78 v1(23.88,5.82) ; 22.93,6.67 C30.1 ; 22.93,6.67 v1(23.11,6.67) 23.37,6.67 23.88,6.16 v1(23.88,5.82) ; 22.93,6.67 22.04,6.67 21.1,7.6 U2.17 ; C1.1 3.43,9.52 3.43,10.54 C2.1 ; 19.42,6.16 v1(20.45,6.16) 20.7,6.41 20.83,6.41 ; 19.42,6.16 U15.2 ; 19.42,6.16 v1(18.88,6.16) 18.16,6.16 ; 3.3,16.83 v1(3.31,16.83) R2.2 ; v1(23.88,5.82) v1(23.88,4.49) v1(23.88,3.24) v1(23.88,2.09) 23.37,1.58 v1(22.99,1.58) v1(21.72,1.58) v1(20.48,1.58) v1(19.3,1.58) v1(17.98,1.58) 17.02,1.58 v1(16.76,1.84) 16.51,2.09 v1(16.51,2.98) v1(16.51,4.12) v1(16.51,5.39) 16.51,5.94 16.99,6.41 17.34,6.41 ; C27.2 19.24,16.19 v1(19.3,16.19) ; v1(4.44,4.76) 4.44,4.37 R1.2 ; U10.2 2.92,7.3 ; C26.2 24.78,12.34 24.43,12.34 23.43,13.34 C5.1 ; U11.2 v1(3.3,12.76)
  Inner1 w0.254: v1(3.43,9.57) 3.43,7.77 v1(2.96,7.3) 2.96,6.01 USB1.13 3.53,5.67 v1(4.44,4.76) 5.36,5.67 USB1.13 7.52,5.67 v1(8.25,6.41) ; 23.75,11.95 23.75,11.87 24,11.62 v1(24,10.35) ; 23.75,11.95 23.04,11.24 20.12,11.24 ; 23.75,11.95 v1(23.75,12.89) 23.41,12.89 22.4,11.87 20.19,11.87 ; v1(18.88,6.16) 17.27,6.16 v1(17.02,6.41) 15.75,7.68 v1(15.11,7.68) 14.48,7.68 13.59,8.57 13.59,11.65 v1(13.02,12.22) ; v1(13.02,12.22) 14.99,14.19 v1(14.99,16.06) 19.18,16.06 v1(19.3,16.19) ; v1(13.02,12.22) 11.46,13.78 v1(8.38,13.78) 7.83,14.33 USB1.14 6.82,15.08 5.08,16.83 v1(3.31,16.83) 2.62,16.14 USB1.14 2.62,13.44 v1(3.3,12.76) 3.43,12.63 v1(3.43,10.47)
  Bottom Layer w0.254: v1(15.11,7.68) 15.94,7.68 C7.1 ; C20.1 26.67,6.35 26.67,6.41 ; v1(24,10.35) 24.07,10.35 C24.2 26.48,7.94 C23.2 ; 26.67,7.94 26.67,6.41 ; 26.67,6.41 25.65,5.39 24.3,5.39 v1(23.88,5.82) ; v1(8.38,13.78) 7.81,13.2 USB1.12 ; R16.2 24.77,3.24 v1(23.88,3.24) ; C6.1 v1(13.02,12.22) 13.02,12.89 C19.1 13.78,13.65 C8.1 ; R7.2 16.26,2.73 v1(16.51,2.98) ; v1(16.51,4.12) 16.32,4.31 C18.1 ; v1(8.25,6.41) 7.87,6.8 USB1.1
  vias: v1(1.22,18.22) v1(1.22,17) v1(1.22,15.78) v1(1.22,14.56) v1(1.22,13.34) v1(1.22,12.13) v1(1.22,10.91) v1(1.22,9.69) v1(1.22,8.47) v1(1.22,7.25) v1(1.22,4.81) v1(1.22,3.59) v1(1.22,2.37) v1(1.22,1.15) v1(2.44,18.22) v1(2.44,17) v1(2.44,15.78) v1(2.44,13.34) v1(2.44,12.13) v1(2.44,3.59) v1(3.66,18.22) v1(3.66,4.81) v1(4.88,18.22) v1(6.1,18.22) v1(7.31,18.22) v1(7.31,17) v1(7.31,15.78) v1(8.53,15.78) v1(8.53,14.56) v1(9.75,14.56) v1(12.19,15.78) v1(12.19,12.13) v1(15.85,3.59) v1(15.85,2.37) v1(15.85,1.15) v1(17.07,1.15) v1(19.65,6.16) v1(21.97,6.79) v1(24.38,3.59) v1(24.38,1.15)
PGND: length 65.6
  Top Layer w0.254: 12.51,5.22 12.57,5.29 12.57,6.01 ; v1(13.34,2.09) 13.34,1.4 C4.1 ; 12.57,6.01 12.83,6.01 ; 12.57,6.01 C3.2 ; 8.82,1.33 v1(7.62,1.33) ; C16.2 11.14,10.06 U12.1 ; LED1.1 4.66,2.47 v1(4.7,2.47)
  Inner1 w0.254: 8.54,7.01 8.64,6.92 8.76,6.92 8.89,6.79 8.89,6.03 7.62,4.76 6.99,4.76 6.35,4.12 6.35,3.62 5.97,3.24 5.33,3.24 ; 5.33,3.24 4.7,2.6 v1(4.7,2.47) 6.48,2.47 v1(7.62,1.33) 8.38,2.09 v1(13.34,2.09) 13.34,5.52 v1(12.83,6.03) 11.18,7.68 v1(11.18,9.08) ; 5.33,3.24 3.81,3.24 2.92,2.35 2.92,0.82 3.32,0.43 14.08,0.43 14.35,0.7 14.35,7.3 13.21,8.44 13.21,10.6 12.95,10.86 10.29,10.86 8.13,8.7 8.13,7.3 8.48,6.95
  vias: v1(13.77,7.25) v1(13.77,6.03) v1(13.77,4.81) v1(13.77,3.59)
VBUS: length 10.9
  Top Layer w0.381: F1.1 arc(9.19,7.51) 8.92,8.32
  Inner2 w0.508: v1(8.76,7.55) v1(9.4,7.55)
  Bottom Layer w0.508: 9.14,7.55 9.53,7.94 9.53,11.36 8.49,12.4 USB1.11 ; 9.14,7.55 v1(8.76,7.55) 8.72,7.6 USB1.2 ; 9.14,7.55 v1(9.4,7.55)
VDD33: length 70
  Top Layer w0.254: 18.54,7.3 18.54,6.92 v1(18.41,6.79) 18.41,7.14 U2.12 U2.13 ; C30.2 v1(21.53,4.12) 22.93,2.72 v1(22.93,2.6) ; v1(16.26,12.38) 16.43,12.38 U2.32 ; U2.6 14.61,9.25 v1(14.57,9.2) ; v1(18.16,14.67) 18.55,14.67 18.8,14.41 ; v1(21.46,5.78) 21.46,6.39 20.93,6.92 v1(20.32,6.92) 20.32,7.23 U2.16
  Top Layer w0.508: 8.13,3.62 8.13,4.12 8.83,4.83 L1.2
  Inner2 w0.254: v1(14.57,9.2) 14.35,8.99 14.35,6.54 14.86,6.03 15.75,6.03 16.26,6.54 16.26,6.79 16.64,7.17 18.03,7.17 v1(18.41,6.79) 20.19,6.79 v1(20.32,6.92) 20.75,6.92 21.46,6.21 v1(21.46,5.78) 21.46,4.25 22.99,2.73 22.99,2.6
  Inner2 w0.508: v1(18.16,14.67) 18.41,14.41 v1(18.41,6.79) ; v1(8.25,4.25) 8.13,4.12 v1(8.13,3.66) 13.68,9.2 v1(14.57,9.2) 14.57,10.69 v1(16.26,12.38)
  Bottom Layer w0.254: C6.2 14.42,9.36 v1(14.57,9.2) ; C8.2 16.75,13.65 ; 16.75,13.65 16.26,13.16 v1(16.26,12.38) 16.13,12.38 14.48,10.73 ; 16.75,13.65 17.15,13.65 v1(18.16,14.67) ; C7.2 18.41,6.86 v1(18.41,6.79) 18.48,6.79 19.49,7.81 19.49,9.46
  Bottom Layer w0.508: v1(8.13,3.66) 8.25,3.78 v1(8.25,4.25) 13.21,9.2 v1(14.57,9.2) 14.6,9.2
ADC_IN: length 41.8
  Top Layer w0.254: v1(28.57,5.52) 28.32,5.52 27.43,6.41 C28.1 27.43,6.54 28.32,7.43 28.32,8.32 28.07,8.57 26.03,8.57 25.65,8.95 25.65,10.23 R10.2 24.14,11.75 22.73,11.75 ; 22.73,11.75 21.74,10.75 U2.22 ; 22.73,11.75 v1(22.73,13.04) 22.73,15.06 R11.1 23.1,16.19 v1(22.86,16.19)
  Bottom Layer w0.254: 22.73,13.4 21.46,14.67 19.05,14.67 18.41,15.3 17.53,15.3 16.13,16.7 13.61,16.7 SW1.1 ; 22.73,13.4 24.64,15.3 27.4,15.3 27.55,15.45 27.55,15.67 27.81,15.94 29.85,15.94 SW3.1 ; 22.73,13.4 v1(22.73,13.04) 22.73,13.02 ; v1(22.86,16.19) 22.7,16.19 ; 22.7,16.19 22.73,16.22 ; 22.7,16.19 21.68,16.19 SW2.1 ; AUDIO1.4 29.74,5.52 v1(28.57,5.52)
CC1: length 6.4
  Top Layer w0.254: v1(5.46,4.76) 5.46,3.88 R1.1
  Bottom Layer w0.254: v1(5.46,4.76) 5.46,5.01 5.33,5.14 5.33,7.81 6.28,8.75 USB1.4
CC2: length 6.2
  Top Layer w0.254: R2.1 5.46,16.18 v1(5.46,15.17)
  Bottom Layer w0.254: v1(5.46,15.17) 5.46,15.05 5.08,14.67 5.08,12.89 6.22,11.75 USB1.10
CLK_XTALA: length 2.3
  Top Layer w0.254: U15.3 17.7,5.13 U2.11
CODEC_VMID: length 4.2
  Top Layer w0.254: C25.2 17.02,15.49 17.02,14.86 17.84,14.03 18.2,14.03 18.7,13.53 U2.28
HP_L: length 16.3
  Top Layer w0.254: v1(28.57,6.79) 28.89,6.79 29.17,6.51 ; 29.17,6.51 C34.1 ; 29.17,6.51 32.73,6.51 C36.1 ; U2.25 20.44,12.89 v1(20.45,12.89)
  Bottom Layer w0.254: v1(28.57,6.79) 28.57,8.43 26.02,10.98 25.65,10.98 24.89,11.75 21.59,11.75 v1(20.45,12.89)
HP_R: length 20.2
  Top Layer w0.254: C33.1 32.7,4.63 v1(28.07,4.63) ; U2.27 19.2,13.42 v1(19.3,13.52)
  Bottom Layer w0.254: v1(19.3,13.52) 19.3,13.16 21.36,11.11 24.76,11.11 27.81,8.06 27.81,4.89 v1(28.07,4.63)
HPVCOM: length 14.9
  Top Layer w0.254: v1(21.08,13.52) 20.07,13.52 19.85,13.31 19.85,13.18 19.7,13.03 19.7,12.65 ; 31.18,9.84 31.18,11.48 31.04,11.62 ; v1(30.26,11.62) 31.04,11.62 ; 31.04,11.62 R8.1
  Bottom Layer w0.254: v1(21.08,13.52) 21.78,13.52 22.1,13.2 22.1,12.84 22.69,12.25 25.27,12.25 25.91,11.62 30.23,11.62
HPVCOM_VSS: length 6.4
  Top Layer w0.254: v1(32.64,10.86) 32.63,10.86 R8.2
  Bottom Layer w0.254: v1(32.64,10.86) 33.87,9.63 AUDIO1.3
LEFT_CHANNEL: length 14.9
  Top Layer w0.254: 32.77,7.81 34.16,9.2 34.16,12.25 32.13,14.28 v1(30.35,14.28) ; C36.2 C35.2 C34.2
  Bottom Layer w0.254: v1(30.35,14.28) 28.7,14.28 AUDIO1.1
MIC_IN: length 7.3
  Top Layer w0.254: C28.2 24.83,7.87 22.45,10.25 U2.21
MICBIAS: length 4.7
  Top Layer w0.254: U2.20 22.06,9.75 v1(22.22,9.59) ; R9.1 23.9,9.44 23.24,10.09 v1(23.24,10.35)
  Bottom Layer w0.254: v1(23.24,10.35) 22.48,9.59 v1(22.22,9.59)
RESET: length 5.7
  Top Layer w0.254: U2.23 21.11,11.24 21.59,11.24 22.15,11.8 22.15,13.92 21.92,14.16 ; 20.31,14.16 20.57,14.41 21.66,14.41 21.92,14.16 ; 21.92,14.16 C5.2
RIGHT_CHANNEL: length 9
  Top Layer w0.254: C31.2 C32.2 C33.2 34.99,3.3 v1(35.56,3.87)
  Bottom Layer w0.254: AUDIO1.2 36.87,5.18 v1(35.56,3.87)
USB_5V: length 8.8
  Top Layer w0.254: R5.1 7.24,4.25 8.64,5.65 9.65,5.65 10.67,6.67 F1.2
  Top Layer w0.381: C3.1 arc(11.64,7.44) F1.2 arc(11.28,6) U14.2
USB_DN: length 17.5
  Top Layer w0.254: U11.1 4.38,12.73 4.38,10.98 ; 4.38,10.98 5.33,10.98 5.97,11.62 7.75,11.62 8.25,11.11 v1(8.64,11.11) 9.91,12.38 9.91,13.14 10.16,13.4 10.79,13.4 11.05,13.65 11.05,14.16 11.3,14.41 11.81,14.41 12.06,14.16 12.57,14.16 13.09,14.67 R4.2 ; 4.38,10.98 4.32,10.98
  Bottom Layer w0.254: 8.28,10.07 8.64,10.43 v1(8.64,11.11) ; 8.28,10.07 8.45,9.9 8.45,9.65 8.05,9.25 USB1.5 ; 8.28,10.07 8.1,10.25 USB1.7
USB_DP: length 15.1
  Top Layer w0.254: U10.1 4.41,9.05 4.38,9.08 5.08,9.08 v1(6.22,10.22) 6.48,10.47 9.02,10.47 11.81,13.27 R3.2
  Bottom Layer w0.254: USB1.6 6.57,9.75 6.22,10.09 6.22,10.35 6.62,10.75 USB1.8
$1N3255: length 4.3
  Top Layer w0.254: R3.1 14.6,12.76 14.85,12.51 15.49,12.51 15.75,12.76 15.75,13.04 16.1,13.4 16.85,13.4 17.2,13.05 U2.31
$1N3294: length 4.3
  Top Layer w0.254: U2.30 17.7,13.12 17.02,13.8 15.72,13.8 14.73,14.79 R4.1
$1N3811: length 2.1
  Top Layer w0.254: LED1.2 6.47,1.72 R5.2
$1N6901: length 6.5
  Top Layer w0.381: 12,1.34 arc(11.11,1.33) C17.2 arc(9.52,2.29) L1.1 arc(9.92,4.29) U14.3
$1N9188: length 3.1
  Top Layer w0.254: C26.1 26.41,12.45 R10.1 R9.2
$1N9400: length 1.7
  Top Layer w0.254: C27.1 R11.2
$1N10061: length 16.1
  Top Layer w0.254: v1(10.92,16.32) 11.43,16.83 24.25,16.83 R15.1
  Bottom Layer w0.254: v1(10.92,16.32) 10.83,16.22 SW1.2
$1N10064: length 9.9
  Top Layer w0.254: R13.1 25.9,16.7 v1(25.27,16.7)
  Bottom Layer w0.254: v1(25.27,16.7) 24.89,16.7 23.37,15.17 19.3,15.17 18.36,16.12 SW2.2
$1N10067: length 2.5
  Top Layer w0.254: R14.1 28.32,16.44 v1(28.07,16.7)
  Bottom Layer w0.254: SW3.2 27.46,16.83 27.94,16.83 v1(28.07,16.7)
$1N10464: length 4
  Top Layer w0.254: L4.2 21.23,2.9 U15.1 U15.4

## Copper pours and planes (outline as drawn; the poured copper is in the pictures)
AGND on Top Layer: 15.75,15.68 18.67,15.68 18.8,15.56 19.69,15.56 19.94,15.81 19.94,16.57 20.17,16.81 20.17,16.83 23.11,16.83 23.5,17.21 23.5,18.06 23.79,18.35 25.02,18.35 25.15,18.22 25.15,17.35 24.64,16.84 24.64,16.51 25.09,16.06 28.83,16.06 29.34,16.57 31.62,16.57 31.62,20 42.04,20 42.04,0.06 25.61,0.06 25.61,4.87 23.05,7.43 20.45,7.43 19.81,8.06 19.81,10.86 21.84,10.86 23.11,9.59 24.26,9.59 24.26,9.61 24.75,10.1 24.75,12.84 24.76,12.86 24.29,13.34 23.47,13.34 22.39,12.25 19.78,12.25 19.73,12.2 16.69,15.24 16.69,15.25 15.75,15.25
AGND on Bottom Layer: 15.75,15.68 18.67,15.68 18.8,15.56 19.69,15.56 19.94,15.81 19.94,16.57 20.17,16.81 20.17,16.83 23.11,16.83 23.5,17.21 23.5,18.06 23.79,18.35 25.02,18.35 25.15,18.22 25.15,17.35 24.64,16.84 24.64,16.51 25.09,16.06 28.83,16.06 29.34,16.57 31.62,16.57 31.62,20 42.04,20 42.04,0.06 25.61,0.06 25.61,4.87 23.05,7.43 20.45,7.43 19.81,8.06 19.81,10.86 21.84,10.86 23.11,9.59 24.26,9.59 24.26,9.61 24.75,10.1 24.75,12.84 24.76,12.86 24.29,13.34 23.47,13.34 22.39,12.25 19.78,12.25 19.73,12.2 16.69,15.24 16.69,15.25 15.75,15.25
AGND on Inner1: 15.75,15.68 18.67,15.68 18.8,15.56 19.69,15.56 19.94,15.81 19.94,16.57 20.17,16.81 20.17,16.83 23.11,16.83 23.5,17.21 23.5,18.06 23.79,18.35 25.02,18.35 25.15,18.22 25.15,17.35 24.64,16.84 24.64,16.51 25.09,16.06 28.83,16.06 29.34,16.57 31.62,16.57 31.62,20 42.04,20 42.04,0.06 25.61,0.06 25.61,4.87 23.05,7.43 20.45,7.43 19.81,8.06 19.81,10.86 21.84,10.86 23.11,9.59 24.26,9.59 24.26,9.61 24.75,10.1 24.75,12.84 24.76,12.86 24.29,13.34 23.47,13.34 22.39,12.25 19.78,12.25 19.73,12.2 16.69,15.24 16.69,15.25 15.75,15.25
AGND on Inner2: 15.75,15.68 18.67,15.68 18.8,15.56 19.69,15.56 19.94,15.81 19.94,16.57 20.17,16.81 20.17,16.83 23.11,16.83 23.5,17.21 23.5,18.06 23.79,18.35 25.02,18.35 25.15,18.22 25.15,17.35 24.64,16.84 24.64,16.51 25.09,16.06 28.83,16.06 29.34,16.57 31.62,16.57 31.62,20 42.04,20 42.04,0.06 25.61,0.06 25.61,4.87 23.05,7.43 20.45,7.43 19.81,8.06 19.81,10.86 21.84,10.86 23.11,9.59 24.26,9.59 24.26,9.61 24.75,10.1 24.75,12.84 24.76,12.86 24.29,13.34 23.47,13.34 22.39,12.25 19.78,12.25 19.73,12.2 16.69,15.24 16.69,15.25 15.75,15.25
DVDD18 on Inner2: 15.88,13.52 16.64,12.76 16.64,11.75 14.99,10.09 14.99,6.72 15.24,6.47 15.82,6.47 15.88,6.41 16.89,7.43 18.03,7.43 18.03,14.28 17.27,15.05 15.88,15.05
GND on Top Layer: 31.63,20 31.63,16.71 31.62,16.7 29.28,16.7 28.77,16.19 24.96,16.19 24.76,16.39 24.76,16.95 25.02,17.21 25.27,17.21 25.27,18.35 25.15,18.48 23.62,18.48 23.37,18.22 23.37,17.33 22.99,16.95 20.07,16.95 19.81,16.7 19.81,16.01 19.48,15.68 18.92,15.68 18.67,15.94 15.62,15.94 15.49,15.81 15.49,15.1 15.56,15.04 16.5,15.04 16.51,15.05 19.56,12 20.98,12 22.55,13.58 23.7,13.58 24.57,12.7 24.57,10.28 24.26,9.97 23.5,9.97 23.37,9.84 21.97,11.24 19.81,11.24 19.56,10.98 19.56,7.9 20.11,7.35 22.94,7.35 25.53,4.76 25.53,0.06 14.54,0.06 14.48,0 14.48,7.3 13.35,8.43 13.35,10.97 13.34,10.98 10.23,10.98 8,8.76 8,7.17 8.38,6.79 8.6,6.79 8.64,6.76 8.64,6.03 7.49,4.89 6.86,4.89 6.22,4.25 6.22,3.74 5.84,3.36 3.81,3.36 2.92,2.47 2.79,2.47 2.79,-0.07 0,-0.07 0,20
GND on Bottom Layer: 31.63,20 31.63,16.71 31.62,16.7 29.28,16.7 28.77,16.19 24.96,16.19 24.76,16.39 24.76,16.95 25.02,17.21 25.27,17.21 25.27,18.35 25.15,18.48 23.62,18.48 23.37,18.22 23.37,17.33 22.99,16.95 20.07,16.95 19.81,16.7 19.81,16.01 19.48,15.68 18.92,15.68 18.67,15.94 15.62,15.94 15.49,15.81 15.49,15.1 15.56,15.04 16.5,15.04 16.51,15.05 19.56,12 20.98,12 22.55,13.58 23.7,13.58 24.57,12.7 24.57,10.28 24.26,9.97 23.5,9.97 23.37,9.84 21.97,11.24 19.81,11.24 19.56,10.98 19.56,7.9 20.11,7.35 22.94,7.35 25.53,4.76 25.53,0.06 14.54,0.06 14.48,0 14.48,7.3 13.35,8.43 13.35,10.97 13.34,10.98 10.23,10.98 8,8.76 8,7.17 8.38,6.79 8.6,6.79 8.64,6.76 8.64,6.03 7.49,4.89 6.86,4.89 6.22,4.25 6.22,3.74 5.84,3.36 3.81,3.36 2.92,2.47 2.79,2.47 2.79,-0.07 0,-0.07 0,20
GND on Inner1: 31.63,20 31.63,16.71 31.62,16.7 29.28,16.7 28.77,16.19 24.96,16.19 24.76,16.39 24.76,16.95 25.02,17.21 25.27,17.21 25.27,18.35 25.15,18.48 23.62,18.48 23.37,18.22 23.37,17.33 22.99,16.95 20.07,16.95 19.81,16.7 19.81,16.01 19.48,15.68 18.92,15.68 18.67,15.94 15.62,15.94 15.49,15.81 15.49,15.1 15.56,15.04 16.5,15.04 16.51,15.05 19.56,12 20.98,12 22.55,13.58 23.7,13.58 24.57,12.7 24.57,10.28 24.26,9.97 23.5,9.97 23.37,9.84 21.97,11.24 19.81,11.24 19.56,10.98 19.56,7.9 20.11,7.35 22.94,7.35 25.53,4.76 25.53,0.06 14.54,0.06 14.48,0 14.48,7.3 13.35,8.43 13.35,10.97 13.34,10.98 10.23,10.98 8,8.76 8,7.17 8.38,6.79 8.6,6.79 8.64,6.76 8.64,6.03 7.49,4.89 6.86,4.89 6.22,4.25 6.22,3.74 5.84,3.36 3.81,3.36 2.92,2.47 2.79,2.47 2.79,-0.07 0,-0.07 0,20
GND on Inner2: 31.63,20 31.63,16.71 31.62,16.7 29.28,16.7 28.77,16.19 24.96,16.19 24.76,16.39 24.76,16.95 25.02,17.21 25.27,17.21 25.27,18.35 25.15,18.48 23.62,18.48 23.37,18.22 23.37,17.33 22.99,16.95 20.07,16.95 19.81,16.7 19.81,16.01 19.48,15.68 18.92,15.68 18.67,15.94 15.62,15.94 15.49,15.81 15.49,15.1 15.56,15.04 16.5,15.04 16.51,15.05 19.56,12 20.98,12 22.55,13.58 23.7,13.58 24.57,12.7 24.57,10.28 24.26,9.97 23.5,9.97 23.37,9.84 21.97,11.24 19.81,11.24 19.56,10.98 19.56,7.9 20.11,7.35 22.94,7.35 25.53,4.76 25.53,0.06 14.54,0.06 14.48,0 14.48,7.3 13.35,8.43 13.35,10.97 13.34,10.98 10.23,10.98 8,8.76 8,7.17 8.38,6.79 8.6,6.79 8.64,6.76 8.64,6.03 7.49,4.89 6.86,4.89 6.22,4.25 6.22,3.74 5.84,3.36 3.81,3.36 2.92,2.47 2.79,2.47 2.79,-0.07 0,-0.07 0,20
PGND on Top Layer: 10.29,10.98 13.34,10.98 13.34,8.51 14.48,7.36 14.48,0 2.86,0 2.79,-0.07 2.79,2.35 3.81,3.36 5.84,3.36 6.22,3.74 6.22,4.25 6.86,4.89 7.49,4.89 8.76,6.16 8.76,6.67 8.64,6.79 8.38,6.79 8,7.17 8,8.7
PGND on Bottom Layer: 10.29,10.98 13.34,10.98 13.34,8.51 14.48,7.36 14.48,0 2.86,0 2.79,-0.07 2.79,2.35 3.81,3.36 5.84,3.36 6.22,3.74 6.22,4.25 6.86,4.89 7.49,4.89 8.76,6.16 8.76,6.67 8.64,6.79 8.38,6.79 8,7.17 8,8.7
PGND on Inner1: 10.29,10.98 13.34,10.98 13.34,8.51 14.48,7.36 14.48,0 2.86,0 2.79,-0.07 2.79,2.35 3.81,3.36 5.84,3.36 6.22,3.74 6.22,4.25 6.86,4.89 7.49,4.89 8.76,6.16 8.76,6.67 8.64,6.79 8.38,6.79 8,7.17 8,8.7
PGND on Inner2: 10.29,10.98 13.34,10.98 13.34,8.51 14.48,7.36 14.48,0 2.86,0 2.79,-0.07 2.79,2.35 3.81,3.36 5.84,3.36 6.22,3.74 6.22,4.25 6.86,4.89 7.49,4.89 8.76,6.16 8.76,6.67 8.64,6.79 8.38,6.79 8,7.17 8,8.7
VBUS on Top Layer: 8.51,8.57 9.69,8.57 9.69,6.23 8.51,6.23
VDD33 on Inner2: 21.59,18.83 21.62,7.53 21.62,7.41 21.72,7.43 21.63,1.84 9.19,1.84 7.11,4.12 8,8.7 14.36,18.83
VDD33 on Inner2: 18.03,14.16 16.64,11.75 14.99,10.1 14.99,6.67 15.21,6.45 15.88,6.45 16.86,7.43 18.03,7.43
VDD33 on Inner2: 18.77,15.43 18.03,14.16 18.03,14.28 17.65,14.67 17.65,15.05 18.03,15.43
USB_5V on Top Layer: 10.29,10.6 13.08,10.6 13.08,4.63 10.29,4.63
$1N6901 on Top Layer: 8.64,5.78 12.45,5.78 12.45,0.82 8.64,0.82

Small or netless copper shapes (teardrops, artwork), in the pictures only: 231 on Top Layer, 97 on Bottom Layer, 53 on Inner1, 19 on Inner2
